# Altium project nucleo_radio_board.PrjPcb
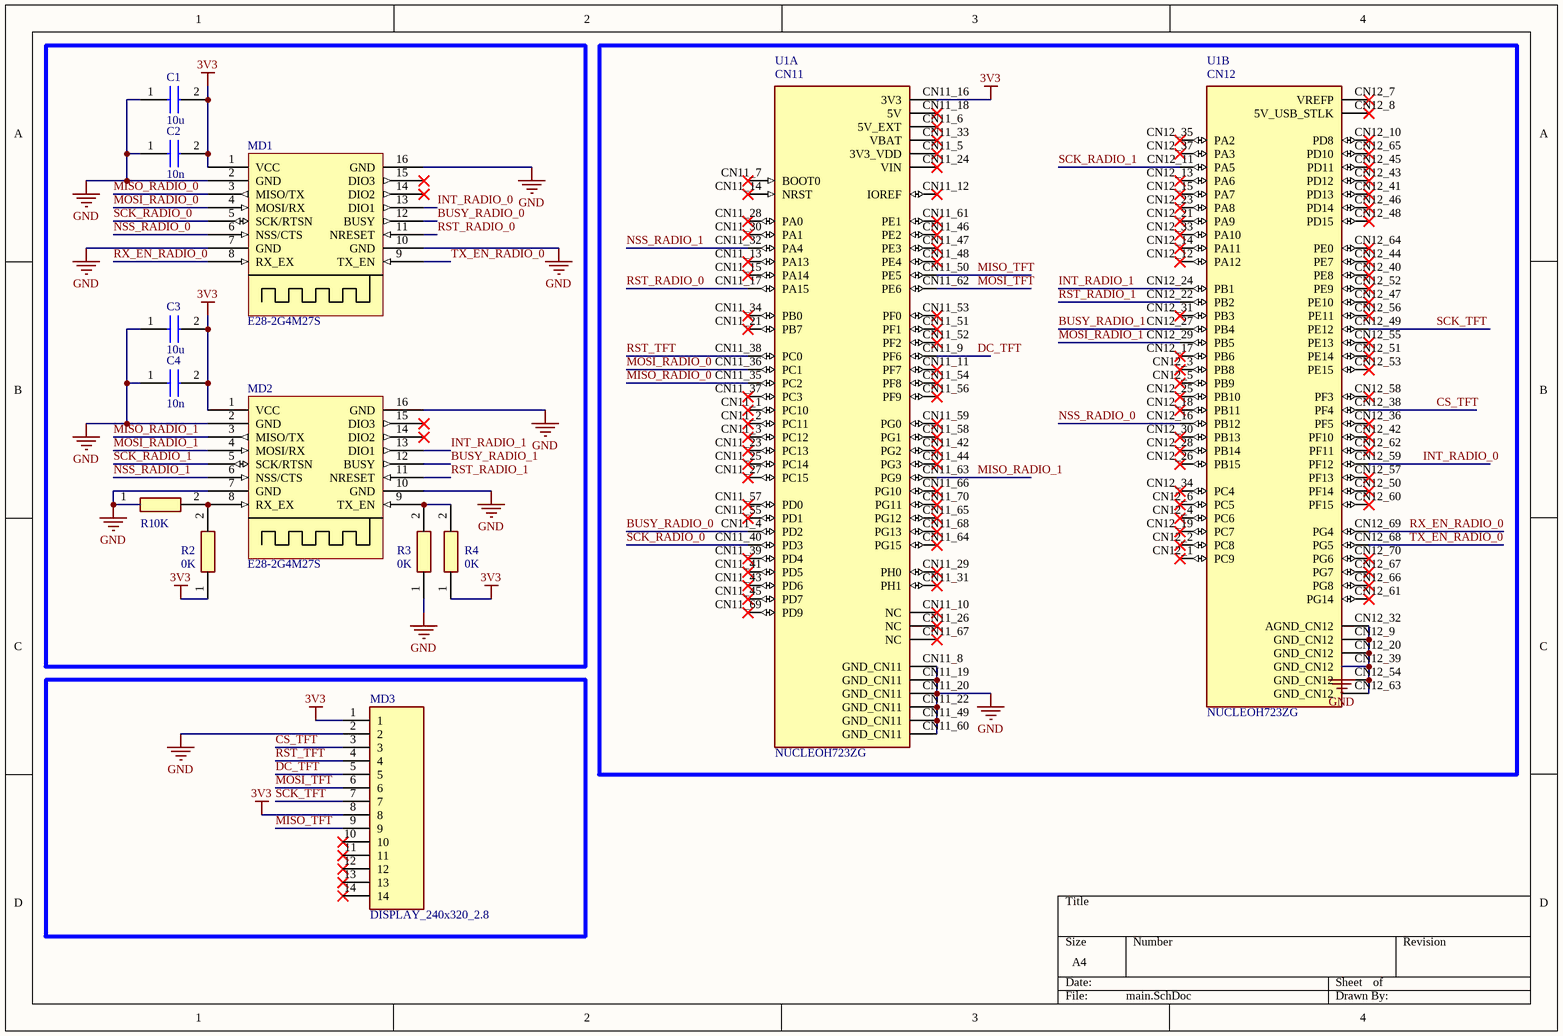
[diagram p0: main.SchDoc]
1 sheet, 12 parts. Net scope: global (net labels, ports and power ports of the same name join across sheets).
Board file: main.PcbDoc

## Sheet main.SchDoc
size A4; SheetNumber: 1; SheetTotal: 1

### Parts
C1  10u  [CAPC1608X95N]
C2  10n  [CAPC1608X95N]
C3  10u  [CAPC1608X95N]
C4  10n  [CAPC1608X95N]
MD1  E28-2G4M27S  [E28-2G4M27S]
MD2  E28-2G4M27S  [E28-2G4M27S]
MD3  DISPLAY_240x320_2.8  [DISPLAY_240x320_2.8]
R1  0K  [RESC1608X55N]
R2  0K  [RESC1608X55N]
R3  0K  [RESC1608X55N]
R4  0K  [RESC1608X55N]
U1  NUCLEOH723ZG  [NEW_NUCLEO]  (parts A,B of 2)

### Nets
3V3: C1.2 C2.2 C3.2 C4.2 MD1.1(VCC) MD2.1(VCC) MD3.1 MD3.8 R2.1 R4.1 U1.CN11_16(3V3)
GND: C1.1 C2.1 C3.1 C4.1 MD1.2(GND) MD1.7(GND) MD1.10(GND) MD1.16(GND) MD2.2(GND) MD2.7(GND) MD2.10(GND) MD2.16(GND) MD3.2 R1.1 R3.1 U1.CN11_8(GND_CN11) U1.CN11_19(GND_CN11) U1.CN11_20(GND_CN11) U1.CN11_22(GND_CN11) U1.CN11_49(GND_CN11) U1.CN11_60(GND_CN11) U1.CN12_9(GND_CN12) U1.CN12_20(GND_CN12) U1.CN12_32(AGND_CN12) U1.CN12_39(GND_CN12) U1.CN12_54(GND_CN12) U1.CN12_63(GND_CN12)
BUSY_RADIO_0: MD1.12(BUSY) U1.CN11_4(PD2)
BUSY_RADIO_1: MD2.12(BUSY) U1.CN12_27(PB4)
CS_TFT: MD3.3 U1.CN12_38(PF4)
DC_TFT: MD3.5 U1.CN11_9(PF6)
INT_RADIO_0: MD1.13(DIO1) U1.CN12_59(PF12)
INT_RADIO_1: MD2.13(DIO1) U1.CN12_24(PB1)
MISO_RADIO_0: MD1.3(MISO/TX) U1.CN11_35(PC2)
MISO_RADIO_1: MD2.3(MISO/TX) U1.CN11_63(PG9)
MISO_TFT: MD3.9 U1.CN11_50(PE5)
MOSI_RADIO_0: MD1.4(MOSI/RX) U1.CN11_36(PC1)
MOSI_RADIO_1: MD2.4(MOSI/RX) U1.CN12_29(PB5)
MOSI_TFT: MD3.6 U1.CN11_62(PE6)
NSS_RADIO_0: MD1.6(NSS/CTS) U1.CN12_16(PB12)
NSS_RADIO_1: MD2.6(NSS/CTS) U1.CN11_32(PA4)
RST_RADIO_0: MD1.11(NRESET) U1.CN11_17(PA15)
RST_RADIO_1: MD2.11(NRESET) U1.CN12_22(PB2)
RST_TFT: MD3.4 U1.CN11_38(PC0)
RX_EN_RADIO_0: MD1.8(RX_EX) U1.CN12_69(PG4)
SCK_RADIO_0: MD1.5(SCK/RTSN) U1.CN11_40(PD3)
SCK_RADIO_1: MD2.5(SCK/RTSN) U1.CN12_11(PA5)
SCK_TFT: MD3.7 U1.CN12_49(PE12)
TX_EN_RADIO_0: MD1.9(TX_EN) U1.CN12_68(PG5)
NetMD2_8: MD2.8(RX_EX) R1.2 R2.2
NetMD2_9: MD2.9(TX_EN) R3.2 R4.2

Not connected (* = marked no-connect by the designer): MD1 14(DIO2)* 15(DIO3)*; MD2 14(DIO2)* 15(DIO3)*; MD3 10* 11* 12* 13* 14*; U1 CN11_1(PC10)* CN11_2(PC11)* CN11_3(PC12)* CN11_5(3V3_VDD)* CN11_6(5V_EXT)* CN11_7(BOOT0)* CN11_10(NC)* CN11_11(PF7)* CN11_12(IOREF)* CN11_13(PA13)* CN11_14(NRST)* CN11_15(PA14)* CN11_18(5V)* CN11_21(PB7)* CN11_23(PC13)* CN11_24(VIN)* CN11_25(PC14)* CN11_26(NC)* CN11_27(PC15)* CN11_28(PA0)* CN11_29(PH0)* CN11_30(PA1)* CN11_31(PH1)* CN11_33(VBAT)* CN11_34(PB0)* CN11_37(PC3)* CN11_39(PD4)* CN11_41(PD5)* CN11_42(PG2)* CN11_43(PD6)* CN11_44(PG3)* CN11_45(PD7)* CN11_46(PE2)* CN11_47(PE3)* CN11_48(PE4)* CN11_51(PF1)* CN11_52(PF2)* CN11_53(PF0)* CN11_54(PF8)* CN11_55(PD1)* CN11_56(PF9)* CN11_57(PD0)* CN11_58(PG1)* CN11_59(PG0)* CN11_61(PE1)* CN11_64(PG15)* CN11_65(PG12)* CN11_66(PG10)* CN11_67(NC)* CN11_68(PG13)* CN11_69(PD9)* CN11_70(PG11)* CN12_1(PC9)* CN12_2(PC8)* CN12_3(PB8)* CN12_4(PC6)* CN12_5(PB9)* CN12_6(PC5)* CN12_7(VREFP)* CN12_8(5V_USB_STLK)* CN12_10(PD8)* CN12_12(PA12)* CN12_13(PA6)* CN12_14(PA11)* CN12_15(PA7)* CN12_17(PB6)* CN12_18(PB11)* CN12_19(PC7)* CN12_21(PA9)* CN12_23(PA8)* CN12_25(PB10)* CN12_26(PB15)* CN12_28(PB14)* CN12_30(PB13)* CN12_31(PB3)* CN12_33(PA10)* CN12_34(PC4)* CN12_35(PA2)* CN12_36(PF5)* CN12_37(PA3)* CN12_40(PE8)* CN12_41(PD13)* CN12_42(PF10)* CN12_43(PD12)* CN12_44(PE7)* CN12_45(PD11)* CN12_46(PD14)* CN12_47(PE10)* CN12_48(PD15)* CN12_50(PF14)* CN12_51(PE14)* CN12_52(PE9)* CN12_53(PE15)* CN12_55(PE13)* CN12_56(PE11)* CN12_57(PF13)* CN12_58(PF3)* CN12_60(PF15)* CN12_61(PG14)* CN12_62(PF11)* CN12_64(PE0)* CN12_65(PD10)* CN12_66(PG8)* CN12_67(PG7)* CN12_70(PG6)*

### Notes on the sheet
- (in symbol NUCLEOH723ZG, part A) CN11
- (in symbol NUCLEOH723ZG, part B) CN12

### Library data of the parts
C1-C4 = C0603C104K1RACAUTO: Capacitor; Manufacturer_Name: KEMET; Datasheet Link: https://connect.kemet.com:7667/gateway/IntelliData-ComponentDocumentation/1.0/download/specsheet/C0603C104K1RACAUTO; Height: 0.95mm; Manufacturer_Part_Number: C0603C104K1RACAUTO; Mouser Part Number: 80-C0603C104K1RAUTO; Mouser Price/Stock: https://www.mouser.co.uk/ProductDetail/KEMET/C0603C104K1RACAUTO?qs=3Rah4i%252BhyCGTQ5uPNXtfZA%3D%3D; Arrow Part Number: C0603C104K1RACAUTO; Arrow Price/Stock: https://www.arrow.com/en/products/c0603c104k1racauto/kemet-corporation?region=europe
MD1 MD2 = E28-2G4M27S: E28-2G4M27S Ebyte SX1280 Module
MD3 = DISPLAY_240x320_2.8: 2.8 inch TFT Module 240×320 ILI9341 GMT028-06T; Manufacturer_Name: Harwin; Manufacturer_Part_Number: M20-7821446; Datasheet Link: https://cdn.harwin.com/pdfs/M20-782.pdf; Height: 8.65mm; Mouser Part Number: 855-M20-7821446; Mouser Price/Stock: https://www.mouser.co.uk/ProductDetail/Harwin/M20-7821446?qs=Jph8NoUxIfX%2FjYzLF0Toqw%3D%3D
R1-R4 = CRCW06034R70FKEAHP: Resistor; Manufacturer_Name: Vishay; Datasheet Link: http://uk.rs-online.com/web/p/products/8206877; Height: 0.55mm; Manufacturer_Part_Number: CRCW06034R70FKEAHP; Mouser Part Number: 71-CRCW06034R70FKEAH; Mouser Price/Stock: https://www.mouser.co.uk/ProductDetail/Vishay-Dale/CRCW06034R70FKEAHP?qs=zlv9Rr0w%252BHo2DV5S%252Bz7lug%3D%3D; Arrow Part Number: CRCW06034R70FKEAHP; Arrow Price/Stock: https://www.arrow.com/en/products/crcw06034r70fkeahp/vishay?region=nac
U1 = NUCLEOH723ZG: STM32H723ZG Nucleo-144 STM32H7 STM32 MCU 32-Bit Embedded Evaluation Board; MF: STMicroelectronics; Value: *; Purchase-URL: https://pricing.snapeda.com/search/part/NUCLEOH723ZG/?ref=eda; Package: None; Check_prices: https://www.snapeda.com/parts/NUCLEOH723ZG/STMicroelectronics/view-part/?ref=eda; MP: NUCLEOH723ZG; Price: None; SnapEDA_Link: https://www.snapeda.com/parts/NUCLEOH723ZG/STMicroelectronics/view-part/?ref=snap; Availability: In Stock